# Altium schematic sheet ElnC_PeakDetector_BO6.SchDoc
size A4; CompanyName: HESSO; Address1: Route du Rawyl 47; Address2: 1950 Sion; Address3: Switzerland; SheetNumber: 1; SheetTotal: 1; PageSetup: Record=PageOptions|CenterHorizontal=True|CenterVertical=True|PrintScale=1.00|XCorrection=1.00|YCorrection=1.00|PrintKind=1|BorderSize=5000000|LeftOffset=0|BottomOffset=0|Orientation=2|PaperLength=1000|PaperWidth=1000|Scale=100|PaperSource=15|PrintQuality=1200|MediaType=1|DitherType=10|PrintScaleMode=1|PaperKind=A4|PaperIndex=9; ProjectName: Project Name
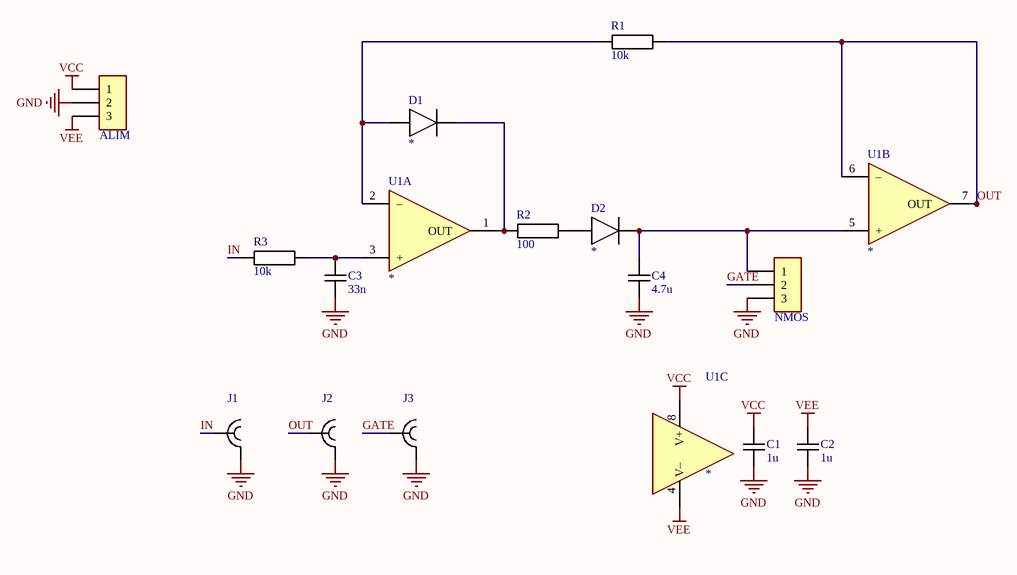
[diagram p0: ElnC_PeakDetector_BO6.SchDoc]

## Parts
ALIM  *  [PinHeader1x3 P2.54]  (value not drawn)
C1  1u  [CAPACITOR 2012 REFLOW]
C2  1u  [CAPACITOR 2012 REFLOW]
C3  33n  [CAPACITOR 2012 REFLOW]
C4  4.7u  [CAPACITOR 2012 REFLOW]
D1  *  [DIODE D5.4 L10.0 P15.0]
D2  *  [DIODE D5.4 L10.0 P15.0]
J1  *  [BNC TH RIGHT ANGLE TE CONNECTIVITY 1-1337543-0]  (value not drawn)
J2  *  [BNC TH RIGHT ANGLE TE CONNECTIVITY 1-1337543-0]  (value not drawn)
J3  *  [BNC TH RIGHT ANGLE TE CONNECTIVITY 1-1337543-0]  (value not drawn)
NMOS  *  [PinHeader1x3 P2.54]  (value not drawn)
R1  10k  [RESISTOR 2012 REFLOW]
R2  100  [RESISTOR 2012 REFLOW]
R3  10k  [RESISTOR 2012 REFLOW]
U1  *  [DIP8 P2.54 W7.62 H5.0]  (parts A,B,C of 3)

## Nets
GND: ALIM.2 C1.2 C2.2 C3.2 C4.2 J1.2 J2.2 J3.2 NMOS.3
VCC: ALIM.1 C1.1 U1.8(V+)
VEE: ALIM.3 C2.1 U1.4(V–)
GATE: J3.1 NMOS.2
IN: J1.1 R3.2
OUT: J2.1 R1.1 U1.6(–) U1.7(OUT)
NetC3_1: C3.1 R3.1 U1.3(+)
NetC4_1: C4.1 D2.1(C) NMOS.1 U1.5(+)
NetD1_1: D1.1(C) R2.2 U1.1(OUT)
NetD1_2: D1.2(A) R1.2 U1.2(–)
NetD2_2: D2.2(A) R2.1

## Notes on the sheet
- Date :
- Revision :
- Sheet
- of
- Design by :

## Library data of the parts
ALIM NMOS = PinHeader1x3: Plug connector; Value: *
C1-C4 = Capacitor
  C1 C2: Value: 1u
  C3: Value: 33n
  C4: Value: 4.7u
D1 D2 = DIODE: Diode generic 2 leads; Value: *
J1-J3 = BNC: Value: *
R1-R3 = Resistor
  R1 R3: Value: 10k
  R2: Value: 100
U1 = OPA DUAL: Generic dual OPA 8 pins; Value: *